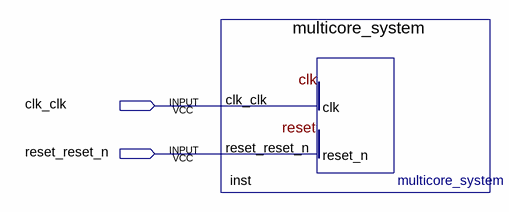
[diagram p0: schematic sheet]
// Quartus schematic TOP.bdf as structural Verilog: 1 symbols, 2 pins
module TOP (
  input  clk_clk,
  input  reset_reset_n
);

  multicore_system inst (.clk_clk(clk_clk), .reset_reset_n(reset_reset_n));
endmodule
